# EAGLE schematic InstAmp (EAGLE 6.2)
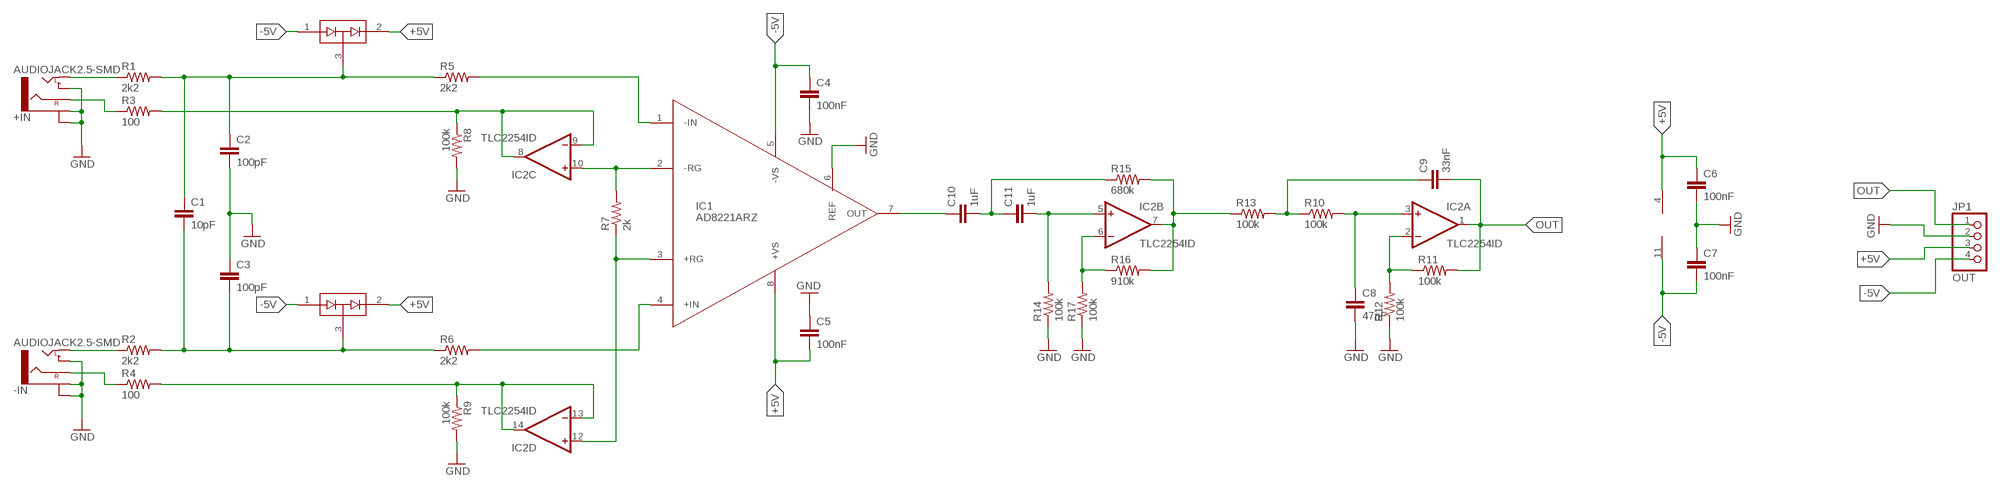
[diagram p0: schematic, sheet 1]

## Parts
+IN  AUDIOJACK2.5-SMD  [AUDIOJACK2.5-SMD]
-IN  AUDIOJACK2.5-SMD  [AUDIOJACK2.5-SMD]
C1  10pF  CAP0805  [0805]
C2  100pF  CAP0805  [0805]
C3  100pF  CAP0805  [0805]
C4  100nF  CAP0805  [0805]
C5  100nF  CAP0805  [0805]
C6  100nF  CAP0805  [0805]
C7  100nF  CAP0805  [0805]
C8  47nF  CAP0805  [0805]
C9  33nF  CAP0805  [0805]
C10  1uF  CAP0805  [0805]
C11  1uF  CAP0805  [0805]
D1  BAV199  BAV99  [SOT23]
D2  BAV199  BAV99  [SOT23]
IC1  AD8221ARZ  [AD8221ARZ]
IC2  TLC2254ID  4AMP_P4+11D  [SO14]
JP1  OUT  PINHD-1X4/90  [1X04/90]
R1  2k2  RESISTOR0805-RES  [0805]
R2  2k2  RESISTOR0805-RES  [0805]
R3  100  RESISTOR0805-RES  [0805]
R4  100  RESISTOR0805-RES  [0805]
R5  2k2  RESISTOR0805-RES  [0805]
R6  2k2  RESISTOR0805-RES  [0805]
R7  2k  RESISTOR0805-RES  [0805]
R8  100k  RESISTOR0805-RES  [0805]
R9  100k  RESISTOR0805-RES  [0805]
R10  100k  RESISTOR0805-RES  [0805]
R11  100k  RESISTOR0805-RES  [0805]
R12  100k  RESISTOR0805-RES  [0805]
R13  100k  RESISTOR0805-RES  [0805]
R14  100k  RESISTOR0805-RES  [0805]
R15  680k  RESISTOR0805-RES  [0805]
R16  910k  RESISTOR0805-RES  [0805]
R17  100k  RESISTOR0805-RES  [0805]

## Nets
+5V: C5.2 C6.1 D1.2(C2) D2.2(C2) IC1.8(+VS) IC2.4(P:V+) JP1.3
-5V: C4.1 C7.2 D1.1(A1) D2.1(A1) IC1.5(-VS) IC2.11(P:V-) JP1.4
GND: +IN.GND1 +IN.GND2 +IN.SW -IN.GND1 -IN.GND2 -IN.SW C2.2 C3.1 C4.2 C5.1 C6.2 C7.1 C8.2 IC1.6(REF) JP1.2 R8.2 R9.2 R12.1 R14.1 R17.1
N$1: +IN.L(LEFT) R1.1
N$2: -IN.R(RIGHT) R4.1
N$3: +IN.R(RIGHT) R3.1
N$4: -IN.L(LEFT) R2.1
N$5: C1.2 C3.2 D2.3(COM) R2.2 R6.1
N$6: C1.1 C2.1 D1.3(COM) R1.2 R5.1
N$7: IC2.13(D:-IN) IC2.14(D:OUT) R4.2 R9.1
N$8: IC1.3(+RG) IC2.12(D:+IN) R7.1
N$9: IC2.7(B:OUT) R13.1 R15.2 R16.2
N$10: IC2.6(B:-IN) R16.1 R17.2
N$11: C10.1 IC1.7(OUT)
N$12: IC1.1(-IN) R5.2
N$13: IC1.4(+IN) R6.2
N$14: C8.1 IC2.3(A:+IN) R10.2
N$15: C9.1 R10.1 R13.2
N$16: IC1.2(-RG) IC2.10(C:+IN) R7.2
N$17: IC2.8(C:OUT) IC2.9(C:-IN) R3.2 R8.1
N$20: C10.2 C11.1 R15.1
N$22: C11.2 IC2.5(B:+IN) R14.2
N$23: IC2.2(A:-IN) R11.1 R12.2
OUT: C9.2 IC2.1(A:OUT) JP1.1 R11.2

## Library data of the parts
+IN -IN = femtoexg:AUDIOJACK2.5-SMD
C1-C11 = SparkFun-Passives:CAP: Capacitor Standard 0603 ceramic capacitor, and 0.1" leaded capacitor.
D1 D2 = SparkFun-DiscreteSemi:BAV99: Two small signal silicon diodes connected anode to cathode. Connections to all three nodes available. DIO-10647; PROD_ID: DIO-10647
IC1 = femtoexg:AD8221ARZ
IC2 = linear:4AMP_P4+11: OP AMP
JP1 = pinhead:PINHD-1X4: PIN HEADER
R1-R17 = SparkFun-Passives:RESISTOR: Resistor Basic schematic elements and footprints for 0603, 1206, and PTH resistors.